# EAGLE design adaptor (EAGLE 6.0)
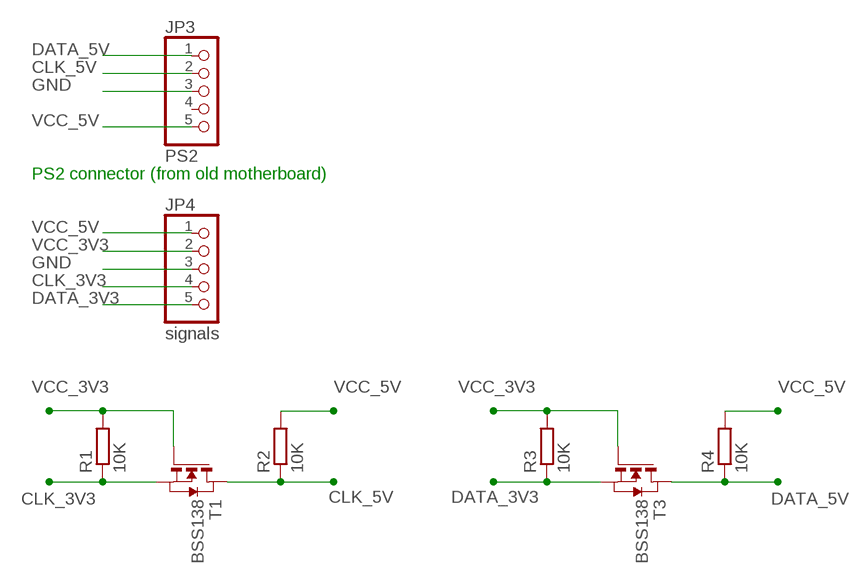
[diagram p0: schematic, sheet 1]

## Parts
JP3  PS2  PINHD-1X5  [1X05]
JP4  signals  PINHD-1X5  [1X05]
R1  10K  R-EU_R0805  [R0805]
R2  10K  R-EU_R0805  [R0805]
R3  10K  R-EU_R0805  [R0805]
R4  10K  R-EU_R0805  [R0805]
T1  BSS138  NMOSSOT23  [SOT-23]
T3  BSS138  NMOSSOT23  [SOT-23]

## Nets
CLK_3V3: JP4.4 R1.1 T1.2(S)
CLK_5V: JP3.2 R2.1 T1.1(D)
DATA_3V3: JP4.5 R3.1 T3.2(S)
DATA_5V: JP3.1 R4.1 T3.1(D)
GND [power]: JP3.3 JP4.3
VCC_3V3 [power]: JP4.2 R1.2 R3.2 T1.3(G) T3.3(G)
VCC_5V [power]: JP3.5 JP4.1 R2.2 R4.2
Unconnected: JP3.4

## Notes on the sheet
- PS2 connector (from old motherboard)

## Library data of the parts
JP3 JP4 = pinhead:PINHD-1X5: PIN HEADER
R1-R4 = rcl:R-EU_: RESISTOR, European symbol
T1 T3 = zetex:NMOSSOT23: MOS FET; OC_FARNELL: unknown; OC_NEWARK: unknown

## Net classes
0 default: width 0.4 mm, clearance 0.2 mm
1 power: width 0.6 mm, drill 1.1 mm, clearance 0.4 mm

## Board
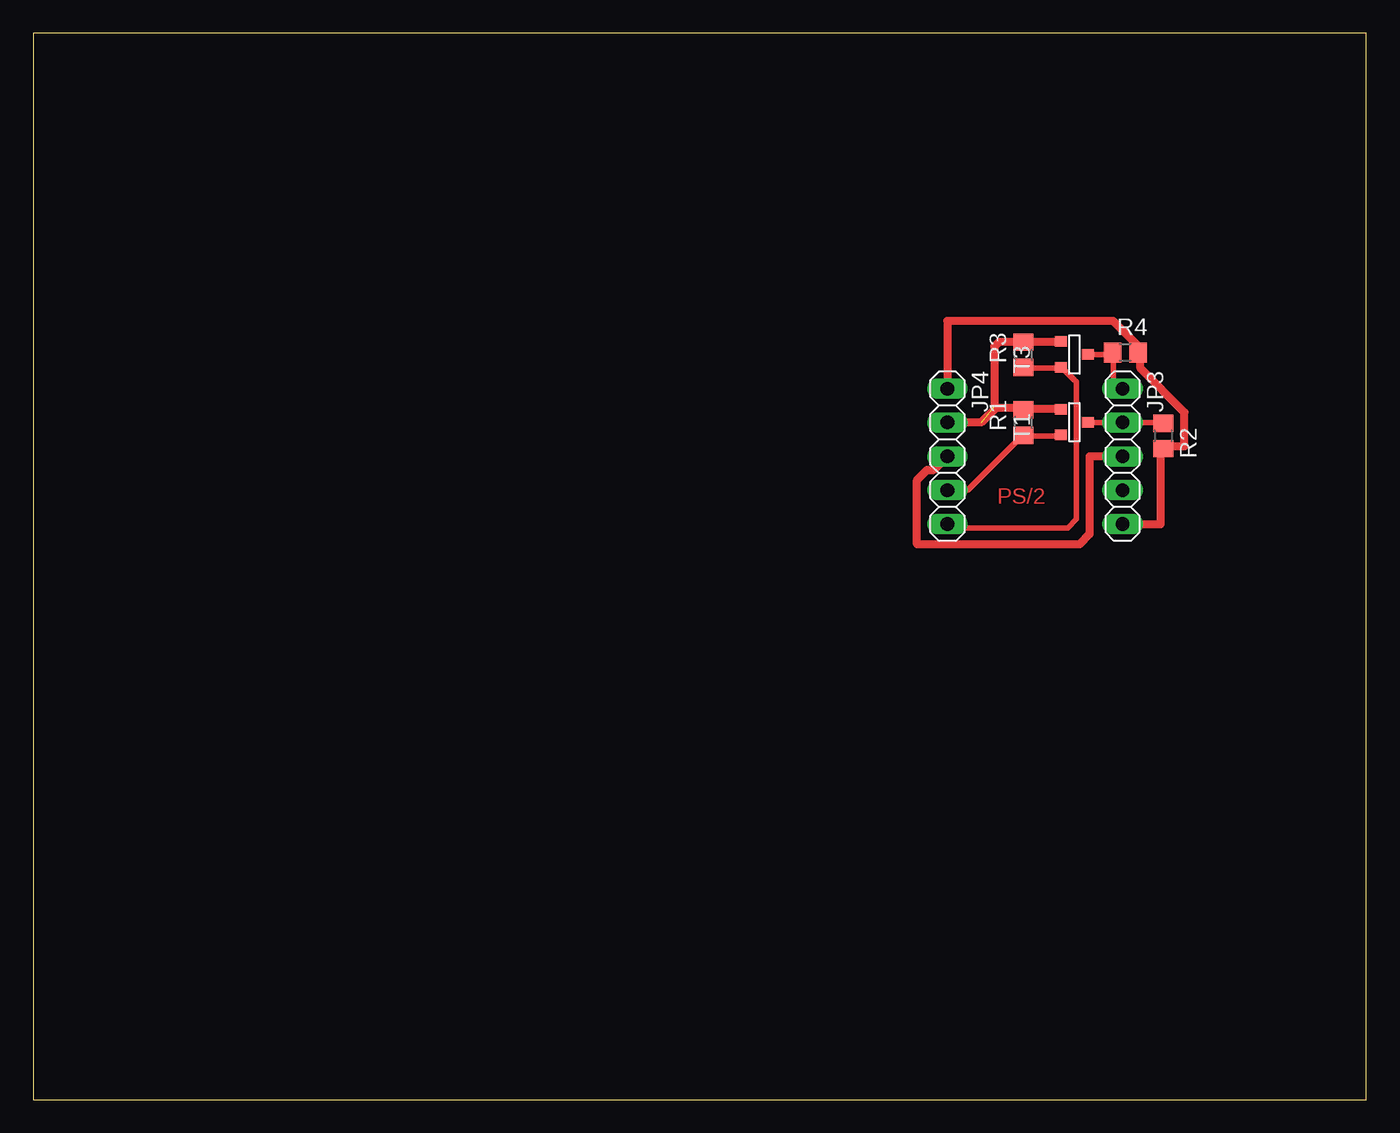
[diagram p1: board, top side]

Size 100 x 80 mm. Coordinates in mm from the lower left corner, seen from the top.
Outline: 0,0 100,0 100,80 0,80 0,0
Copper layers (1*16): Top 0.035mm / dielectric 1.5mm / Bottom 0.035mm
Design rules: minimum track width 10mil, minimum drill 24mil, track to track 8mil, track to pad 8mil, pad to pad 8mil, via to via 8mil, smd to smd 8mil, copper to edge 40mil, drill to drill 8mil, minimum pad ring 10mil, minimum via ring 8mil, stop-mask expansion 4mil, vias tented up to drill 0mil, thermal gap 10mil

### Footprints (pad centres in the part's own frame; a part is rotated, then mirrored left to right if it is on the bottom)
1X05 = drill 1.016 long: 1 -5.08,0; 2 -2.54,0; 3 0,0; 4 2.54,0; 5 5.08,0
R0805 = smd 1.3 x 1.5: 1 -0.95,0; 2 0.95,0
SOT-23 = smd 0.787 x 0.889: 1 0.025,-1.016; 2 -0.94,1.016; 3 0.991,1.016

### Placement (x,y rotation side)
JP3  81.72,48.26 270 top
JP4  68.58,48.26 270 top
R1  74.3,50.8 90 top
R2  84.77,49.8 270 top
R3  74.3,55.88 90 top
R4  81.92,56.06 0 top
T1  78.11,50.8 90 top
T3  78.11,55.88 90 top

### Tracks (layer width: path | path; a pad name or v marks a point on that pad's centre or on a via)
CLK_3V3
  Top 0.4: T1.2 76.96,49.78 74.42,49.78 R1.1 74.17,49.78 70.1,45.72 JP4.4
CLK_5V
  Top 0.4: T1.1 79.25,50.8 JP3.2 84.58,50.8 R2.1
DATA_3V3
  Top 0.254: 77.22,54.86 77.24,54.86
  Top 0.4: R3.1 74.42,54.86 76.96,54.86 T3.2 77.22,54.86 77.98,54.1 78.1,54 78.25,53.88 78.25,43.55 77.6,42.9 68.86,42.9 JP4.5
DATA_5V
  Top 0.4: T3.1 79.25,55.88 80.77,55.88 R4.1 81.03,55.88 81.03,53.34 JP3.1
GND
  Top 0.6: JP4.3 67.56,47.24 67.06,47.24 66.29,46.48 66.29,41.66 78.49,41.66 79.25,42.42 79.25,48.26 JP3.3
VCC_3V3  (1 unrouted)
  Top 0.4: 74.38,51.79 73.91,51.79 73.8,51.9 | 72.1,52 72.2,51.9
  Top 0.6: T1.3 74.38,51.79 74.38,51.75 R1.2 | 73.8,51.9 72.2,51.9 71.1,50.8 JP4.2 | T3.3 77,56.88 74.38,56.88 R3.2 72.43,56.83 72.1,56.5 72.1,51.78 71.12,50.8
VCC_5V
  Top 0.6: JP3.5 84.58,43.18 84.58,48.77 R2.2 84.84,49.02 86.36,49.02 86.36,51.56 83.06,54.86 83.06,55.88 R4.2 82.8,56.13 82.8,56.64 81.03,58.42 68.58,58.42 JP4.1

### Text on the board
Top: PS/2